# EAGLE design Arduino-DUE-V03 (EAGLE 7.2.0)
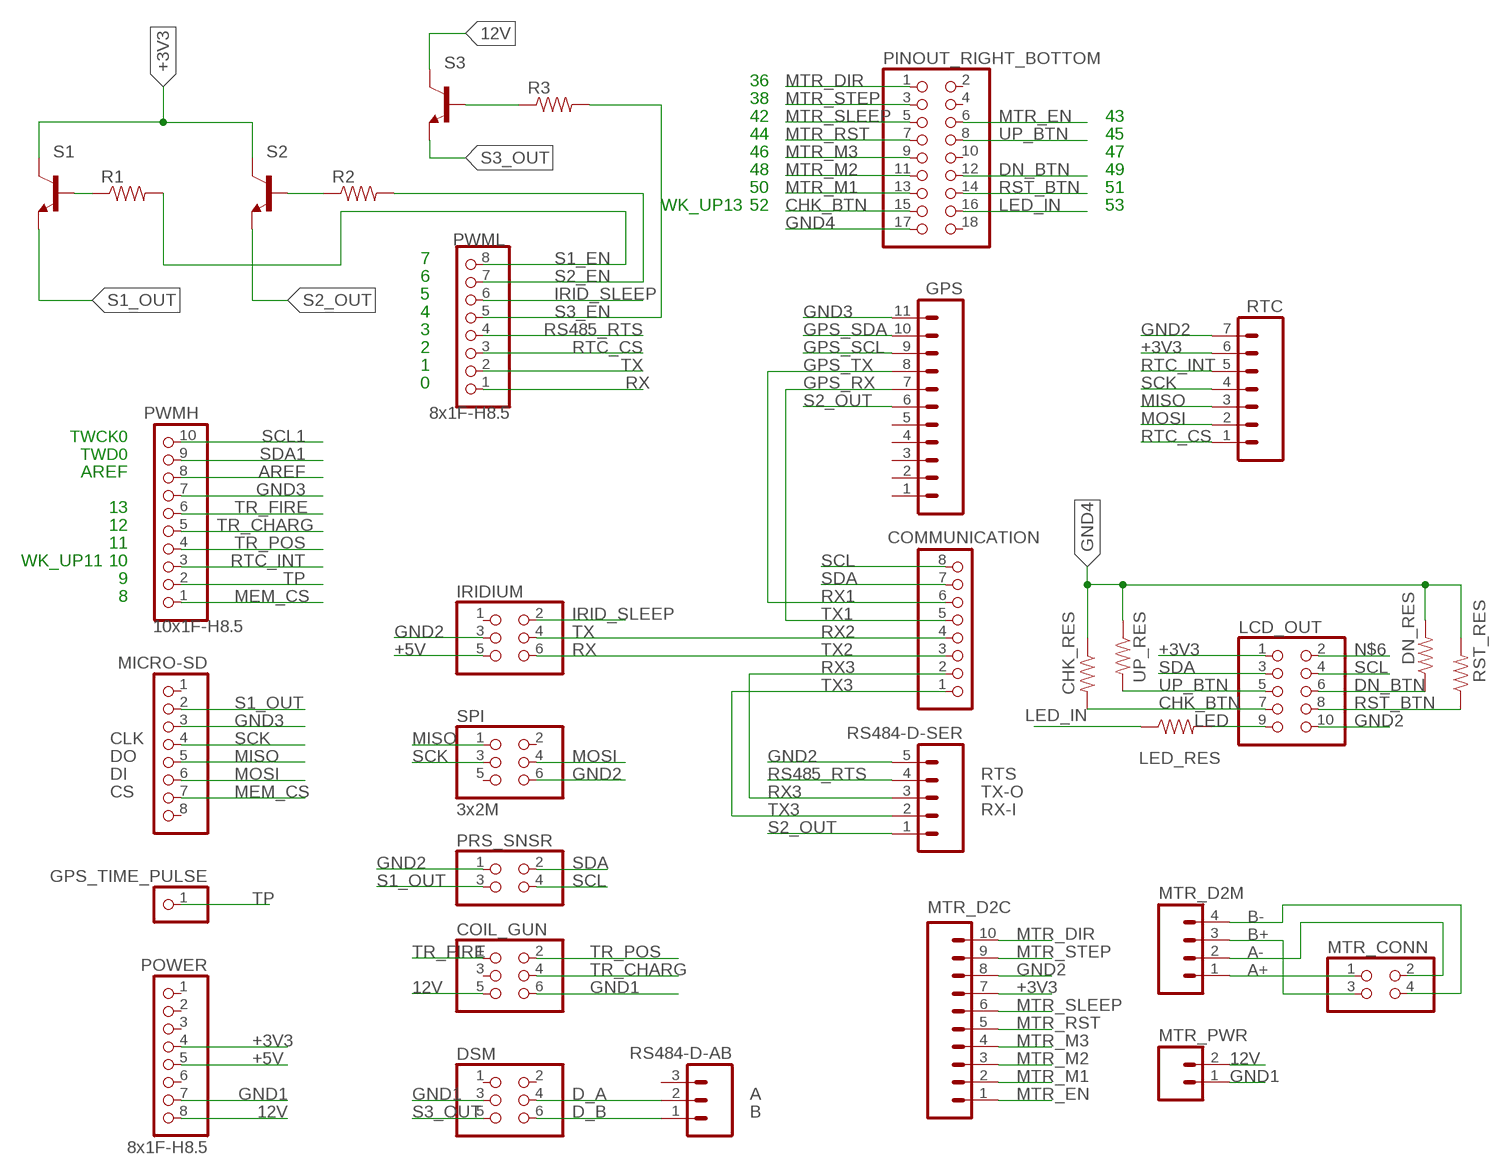
[diagram p0: schematic, sheet 1]

## Parts
CHK_RES  RESISTORPTH-1/4W  [AXIAL-0.4]
COIL_GUN  PINHD-2X3  [2X03]
COMMUNICATION  8x1F-H8.5  PINHD-1X8  [1X08]
DN_RES  RESISTORPTH-1/4W  [AXIAL-0.4]
DSM  PINHD-2X3  [2X03]
GPS  M111.27MM  [1X11-1.27MM]
GPS_TIME_PULSE  PINHD-1X1  [1X01]
IRIDIUM  PINHD-2X3  [2X03]
LCD_OUT  PINHD-2X5  [2X05]
LED_RES  RESISTORPTH-1/4W  [AXIAL-0.4]
MICRO-SD  PINHD-1X8BIG  [1X08-BIG]
MTR_CONN  PINHD-2X2  [2X02]
MTR_D2C  M10SILK_FEMALE_PTH  [1X10]
MTR_D2M  M04NO_SILK_ALL_ROUND  [1X04_NO_SILK_ALL_ROUND]
MTR_PWR  M02PTH  [1X02]
PINOUT_RIGHT_BOTTOM  PINHD-2X9  [2X09]
POWER  8x1F-H8.5  PINHD-1X8  [1X08]
PRS_SNSR  PINHD-2X2  [2X02]
PWMH  10x1F-H8.5  PINHD-1X10  [1X10]
PWML  8x1F-H8.5  PINHD-1X8  [1X08]
R1  RESISTORPTH-1/4W  [AXIAL-0.4]
R2  RESISTORPTH-1/4W  [AXIAL-0.4]
R3  RESISTORPTH-1/4W  [AXIAL-0.4]
RS484-D-AB  M03PTH  [1X03]
RS484-D-SER  M05PTH  [1X05]
RST_RES  RESISTORPTH-1/4W  [AXIAL-0.4]
RTC  M07  [1X07]
S1  2N3904  [TO92]
S2  2N3904  [TO92]
S3  2N3904  [TO92]
SPI  3x2M  PINHD-2X3  [2X03]
UP_RES  RESISTORPTH-1/4W  [AXIAL-0.4]

## Nets
12V [12V]: COIL_GUN.5 MTR_PWR.2 POWER.8 S3.1(C)
+3V3 [Power]: LCD_OUT.1 MTR_D2C.7 POWER.4 RTC.6 S1.1(C) S2.1(C)
+5V [Power]: IRIDIUM.5 POWER.5
A+ [12V]: MTR_CONN.1 MTR_D2M.1
A- [12V]: MTR_CONN.2 MTR_D2M.2
AREF: PWMH.8
B+ [12V]: MTR_CONN.3 MTR_D2M.3
B- [12V]: MTR_CONN.4 MTR_D2M.4
CHK_BTN: CHK_RES.P$2 LCD_OUT.7 PINOUT_RIGHT_BOTTOM.15
D_A [Power]: DSM.4 RS484-D-AB.2
D_B [Power]: DSM.6 RS484-D-AB.1
DN_BTN: DN_RES.P$1 LCD_OUT.6 PINOUT_RIGHT_BOTTOM.12
GND1 [12V]: COIL_GUN.6 DSM.3 MTR_PWR.1 POWER.7
GND2 [Power]: IRIDIUM.3 LCD_OUT.10 MTR_D2C.8 PRS_SNSR.1 RS484-D-SER.5 RTC.7 SPI.6
GND3 [Power]: GPS.11 MICRO-SD.3 PWMH.7
GND4 [Power]: CHK_RES.P$1 DN_RES.P$2 PINOUT_RIGHT_BOTTOM.17 RST_RES.P$2 UP_RES.P$1
GPS_RX: COMMUNICATION.5 GPS.7
GPS_SCL: GPS.9
GPS_SDA: GPS.10
GPS_TX: COMMUNICATION.6 GPS.8
IRID_SLEEP: IRIDIUM.2 PWML.6
LED: LCD_OUT.9 LED_RES.P$2
LED_IN: LED_RES.P$1 PINOUT_RIGHT_BOTTOM.16
MEM_CS: MICRO-SD.7 PWMH.1
MISO: MICRO-SD.5 RTC.3 SPI.1
MOSI: MICRO-SD.6 RTC.2 SPI.4
MTR_DIR: MTR_D2C.10 PINOUT_RIGHT_BOTTOM.1
MTR_EN: MTR_D2C.1 PINOUT_RIGHT_BOTTOM.6
MTR_M1: MTR_D2C.2 PINOUT_RIGHT_BOTTOM.13
MTR_M2: MTR_D2C.3 PINOUT_RIGHT_BOTTOM.11
MTR_M3: MTR_D2C.4 PINOUT_RIGHT_BOTTOM.9
MTR_RST: MTR_D2C.5 PINOUT_RIGHT_BOTTOM.7
MTR_SLEEP: MTR_D2C.6 PINOUT_RIGHT_BOTTOM.5
MTR_STEP: MTR_D2C.9 PINOUT_RIGHT_BOTTOM.3
N$1: R1.P$1 S1.2(B)
N$2: R2.P$1 S2.2(B)
N$4: R3.P$1 S3.2(B)
N$6: LCD_OUT.2
RS485_RTS: PWML.4 RS484-D-SER.4
RST_BTN: LCD_OUT.8 PINOUT_RIGHT_BOTTOM.14 RST_RES.P$1
RTC_CS: PWML.3 RTC.1
RTC_INT: PWMH.3 RTC.5
RX [USB]: PWML.1
RX2: COMMUNICATION.4 IRIDIUM.4
RX3: COMMUNICATION.2 RS484-D-SER.3
S1_EN: PWML.8 R1.P$2
S1_OUT [Power]: MICRO-SD.2 PRS_SNSR.3 S1.3(E)
S2_EN: PWML.7 R2.P$2
S2_OUT [Power]: GPS.6 RS484-D-SER.1 S2.3(E)
S3_EN: PWML.5 R3.P$2
S3_OUT [12V]: DSM.5 S3.3(E)
SCK: MICRO-SD.4 RTC.4 SPI.3
SCL: COMMUNICATION.8 LCD_OUT.4 PRS_SNSR.4
SCL1: PWMH.10
SDA: COMMUNICATION.7 LCD_OUT.3 PRS_SNSR.2
SDA1: PWMH.9
TP: GPS_TIME_PULSE.1 PWMH.2
TR_CHARG: COIL_GUN.4 PWMH.5
TR_FIRE: COIL_GUN.1 PWMH.6
TR_POS: COIL_GUN.2 PWMH.4
TX: PWML.2
TX2: COMMUNICATION.3 IRIDIUM.6
TX3: COMMUNICATION.1 RS484-D-SER.2
UP_BTN: LCD_OUT.5 PINOUT_RIGHT_BOTTOM.8 UP_RES.P$2
Unconnected: COIL_GUN.3 DSM.1 DSM.2 GPS.1 GPS.2 GPS.3 GPS.4 GPS.5 IRIDIUM.1 MICRO-SD.1 MICRO-SD.8 PINOUT_RIGHT_BOTTOM.2 PINOUT_RIGHT_BOTTOM.4 PINOUT_RIGHT_BOTTOM.10 PINOUT_RIGHT_BOTTOM.18 POWER.1 POWER.2 POWER.3 POWER.6 RS484-D-AB.3 SPI.2 SPI.5

## Notes on the sheet
- 36
- 38
- 42 | 43
- 44 | 45
- 46 | 47
- 48 | 49
- 50 | 51
- WK_UP13 | 52 | 53
- 7
- 6
- 5
- 4
- 3
- 2
- 1
- 0
- TWCK0
- TWD0
- AREF
- 13
- 12
- 11
- WK_UP11 | 10
- 9
- 8 | RX1
- TX1
- TX
- RX
- CLK
- DO
- DI | RTS
- CS | TX-O
- RX-I
- A
- B

## Library data of the parts
CHK_RES DN_RES LED_RES R1-R3 RST_RES UP_RES = SparkFun-Passives:RESISTOR: Resistor Basic schematic elements and footprints for 0603, 1206, and PTH resistors.
COIL_GUN DSM IRIDIUM = pinhead:PINHD-2X3: PIN HEADER
COMMUNICATION POWER PWML = SmartPrj:PINHD-1X8: PIN HEADER
GPS = SparkFun-Connectors:M11: Header 11 Standard 11-pin 0.1" header. Use with straight break away headers (SKU : PRT-00116), right angle break away headers (PRT-00553), swiss pins (PRT-00743), machine pins (PRT-00117), and female headers (PRT-00115).
GPS_TIME_PULSE = pinhead:PINHD-1X1: PIN HEADER
LCD_OUT = pinhead:PINHD-2X5: PIN HEADER
MICRO-SD = adafruit:PINHD-1X8: PIN HEADER
MTR_CONN PRS_SNSR = pinhead:PINHD-2X2: PIN HEADER
MTR_D2C = SparkFun-Connectors:M10: Header 10 Standard 10-pin 0.1" header. Use with straight break away headers (SKU : PRT-00116), right angle break away headers (PRT-00553), swiss pins (PRT-00743), machine pins (PRT-00117), and female headers (PRT-00115).; PROD_ID: CONN-11563
MTR_D2M = SparkFun-Connectors:M04: Header 4 Standard 4-pin 0.1" header. Use with straight break away headers (SKU : PRT-00116), right angle break away headers (PRT-00553), swiss pins (PRT-00743), machine pins (PRT-00117), and female headers (PRT-00115). Molex polarized connector foot print use with SKU : PRT-08231 with associated crimp pins and housings. 1MM SMD Version SKU: PRT-10208
MTR_PWR = SparkFun-Connectors:M02: Standard 2-pin 0.1" header. Use with - straight break away headers ( PRT-00116) - right angle break away headers (PRT-00553) - swiss pins (PRT-00743) - machine pins (PRT-00117) - female headers (PRT-00115) Molex polarized connector foot print use with: PRT-08233 with associated crimp pins and housings. 2.54_SCREWTERM for use with PRT-10571. 3.5mm Screw Terminal footprints for PRT-08084 5mm Screw Terminal footprints for use with PRT-08432
PINOUT_RIGHT_BOTTOM = pinhead:PINHD-2X9: PIN HEADER
PWMH = SmartPrj:PINHD-1X10: PIN HEADER
RS484-D-AB = SparkFun-Connectors:M03: Header 3 Standard 3-pin 0.1" header. Use with straight break away headers (SKU : PRT-00116), right angle break away headers (PRT-00553), swiss pins (PRT-00743), machine pins (PRT-00117), and female headers (PRT-00115). Molex polarized connector foot print use with SKU : PRT-08232 with associated crimp pins and housings.
RS484-D-SER = SparkFun-Connectors:M05: Header 5 Standard 5-pin 0.1" header. Use with straight break away headers (SKU : PRT-00116), right angle break away headers (PRT-00553), swiss pins (PRT-00743), machine pins (PRT-00117), and female headers (PRT-00115). Molex polarized connector foot print use with SKU : PRT-08230 with associated crimp pins and housings.
RTC = SparkFun-Connectors:M07: Header 7 Standard 7-pin 0.1" header. Use with straight break away headers (SKU : PRT-00116), right angle break away headers (PRT-00553), swiss pins (PRT-00743), machine pins (PRT-00117), and female headers (PRT-00115). NOTES ON THE VARIANTS LOCK and LOCK_LONGPADS... This footprint was designed to help hold the alignment of a through-hole component (i.e. 7-pin header) while soldering it into place. You may notice that each hole has been shifted either up or down by 0.005 of an inch from it's more standard position (which is usually a perfectly straight line). This slight alteration caused the pins (the squares in the middle) to touch the edges of the holes. Because they are alternating, it causes a "brace" to hold the header in place. 0.005 has proven to be the perfect amount of "off-center" position when using our standard breakaway headers. Although looks a little odd when you look at the bare footprint, once you have a header in there, the alteration is very hard to notice. Also, if you push a header all the way into place, it is covered up entirely on the bottom side. This idea of altering the position of holes to aid alignment will be further integrated into the Sparkfun Library for other footprints. It can help hold any component with 3 or more connection pins.
S1-S3 = transistor:2N3904: NPN TRANSISTOR
SPI = SmartPrj:PINHD-2X3: PIN HEADER

## Net classes
0 default: width 0.203 mm, drill 0.406 mm, clearance 0.203 mm
1 USB: width 0.889 mm, drill 0.889 mm, clearance 0.889 mm
5 12V: width 0.61 mm, drill 0.406 mm, clearance 0.61 mm
6 Power: width 0.381 mm, drill 0.406 mm, clearance 0.381 mm

## Board
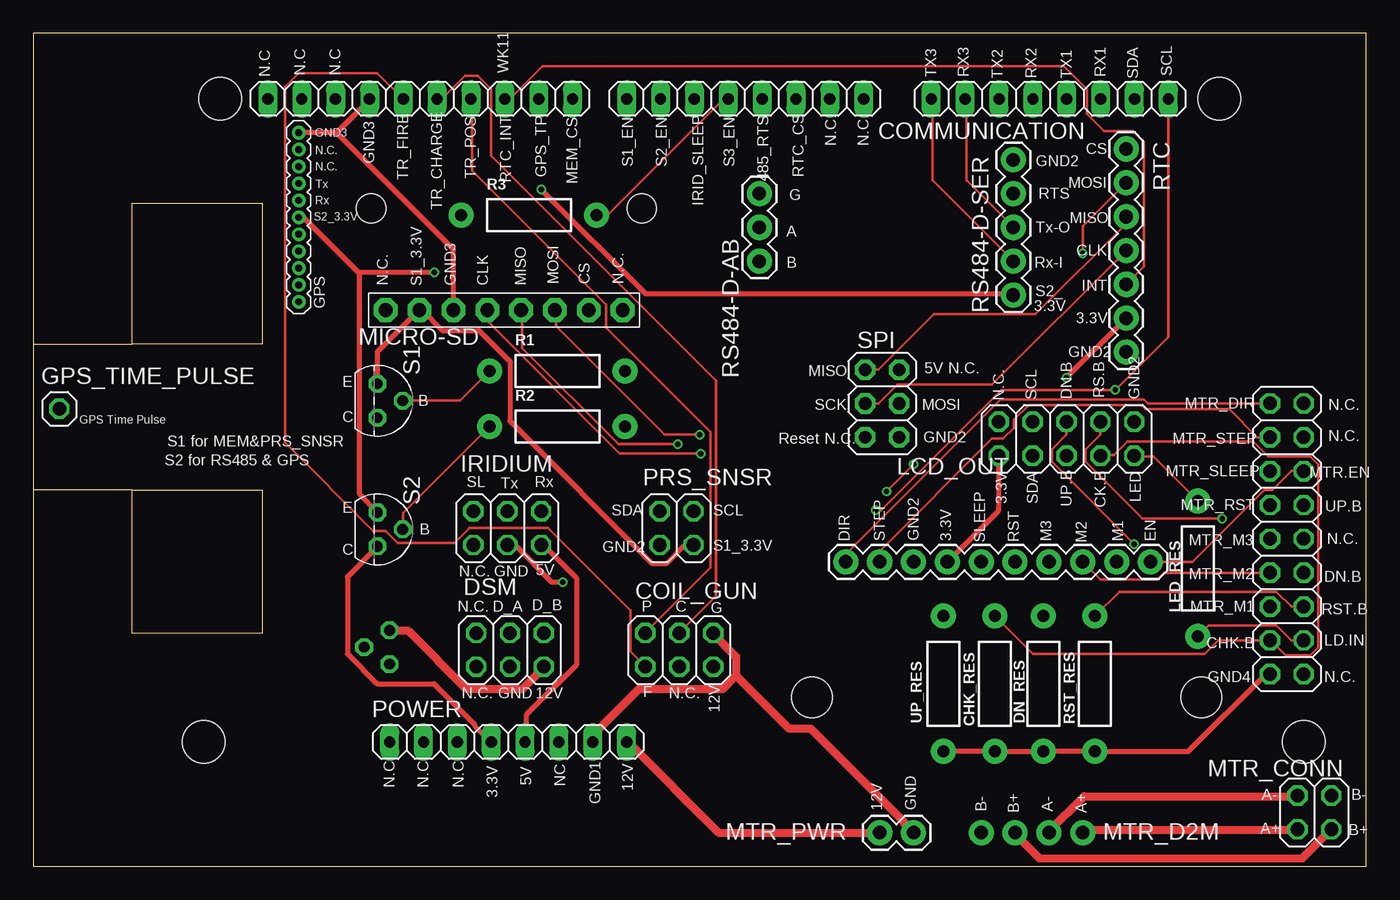
[diagram p1: board, top side]
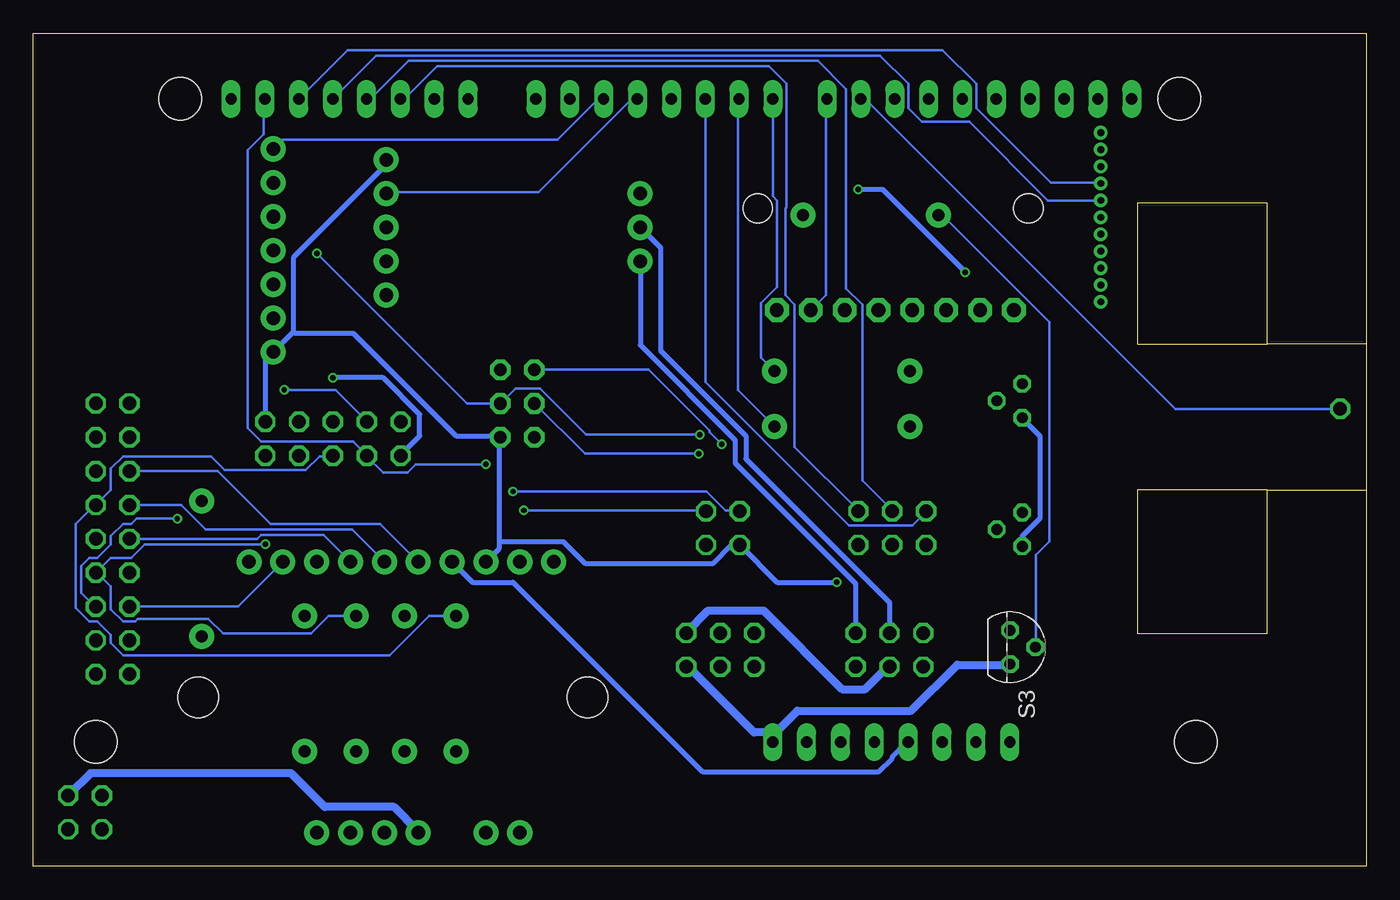
[diagram p2: board, bottom side, seen from below]

Size 100 x 62.52 mm. Coordinates in mm from the lower left corner, seen from the top.
Outline: 0,39.22 0,62.52 100,62.52 100,0 0,0 0,28.25
Outline: 0,39.22 7.43,39.22
Outline: 7.43,39.22 7.43,49.78 17.19,49.78 17.19,39.22 7.43,39.22
Outline: 0,39.22 0,28.25
Outline: 7.43,28.25 17.19,28.25 17.19,17.49 7.43,17.49 7.43,28.25
Outline: 7.43,28.25 0,28.25
Copper layers (1*16): Top 0.035mm / dielectric 1.5mm / Bottom 0.035mm
Design rules "Elecrow_2-layer_eagle_rule": minimum track width 6mil, minimum drill 12mil, track to track 6mil, track to pad 6mil, pad to pad 6mil, via to via 6mil, smd to smd 0mil, copper to edge 10mil, drill to drill 10mil, minimum pad ring 10mil, minimum via ring 6mil, stop-mask expansion 2mil, vias tented up to drill 100mil, thermal gap 10mil
Holes 3.2 mm at 14.04,57.61 88.97,57.61 95.32,9.35 12.77,9.35
Holes 2.2 mm at 45.66,49.38 25.34,49.38

### Footprints (pad centres in the part's own frame; a part is rotated, then mirrored left to right if it is on the bottom)
AXIAL-0.4 = drill 0.9 pad 1.88: P$1 -5.08,0; P$2 5.08,0
2X03 = drill 1.016 octagon: 1 -2.54,-1.27; 2 -2.54,1.27; 3 0,-1.27; 4 0,1.27; 5 2.54,-1.27; 6 2.54,1.27
1X08 = drill 0.85 pad 1.422 long: 1 -8.89,0; 2 -6.35,0; 3 -3.81,0; 4 -1.27,0; 5 1.27,0; 6 3.81,0; 7 6.35,0; 8 8.89,0
1X11-1.27MM = drill 0.508 pad 1: 1 0,0; 2 1.27,0; 3 2.54,0; 4 3.81,0; 5 5.08,0; 6 6.35,0; 7 7.62,0; 8 8.89,0; 9 10.16,0; 10 11.43,0; 11 12.7,0
1X01 = drill 1.016 octagon: 1 0,0
2X05 = drill 1.016 octagon: 1 -5.08,-1.27; 2 -5.08,1.27; 3 -2.54,-1.27; 4 -2.54,1.27; 5 0,-1.27; 6 0,1.27; 7 2.54,-1.27; 8 2.54,1.27; 9 5.08,-1.27; 10 5.08,1.27
1X08-BIG = drill 1.016 pad 1.778 octagon: 1 -8.89,0; 2 -6.35,0; 3 -3.81,0; 4 -1.27,0; 5 1.27,0; 6 3.81,0; 7 6.35,0; 8 8.89,0
2X02 = drill 1.016 octagon: 1 -1.27,-1.27; 2 -1.27,1.27; 3 1.27,-1.27; 4 1.27,1.27
1X10 = drill 1.016 pad 1.88: 1 0,0; 2 2.54,0; 3 5.08,0; 4 7.62,0; 5 10.16,0; 6 12.7,0; 7 15.24,0; 8 17.78,0; 9 20.32,0; 10 22.86,0
1X04_NO_SILK_ALL_ROUND = drill 1.016 pad 1.88: 1 0,0; 2 2.54,0; 3 5.08,0; 4 7.62,0
1X02 = drill 1.016 pad 1.88: 1 0,0; 2 2.54,0
2X09 = drill 1.016 octagon: 1 -10.16,-1.27; 2 -10.16,1.27; 3 -7.62,-1.27; 4 -7.62,1.27; 5 -5.08,-1.27; 6 -5.08,1.27; 7 -2.54,-1.27; 8 -2.54,1.27; 9 0,-1.27; 10 0,1.27; 11 2.54,-1.27; 12 2.54,1.27; 13 5.08,-1.27; 14 5.08,1.27; 15 7.62,-1.27; 16 7.62,1.27; 17 10.16,-1.27; 18 10.16,1.27
1X10' = drill 0.85 pad 1.422 long: 1 -11.43,0; 2 -8.89,0; 3 -6.35,0; 4 -3.81,0; 5 -1.27,0; 6 1.27,0; 7 3.81,0; 8 6.35,0; 9 8.89,0; 10 11.43,0
1X03 = drill 1.016 pad 1.88: 1 0,0; 2 2.54,0; 3 5.08,0
1X05 = drill 1.016 pad 1.88: 1 0,0; 2 2.54,0; 3 5.08,0; 4 7.62,0; 5 10.16,0
1X07 = drill 1.016 pad 1.88: 1 0,0; 2 2.54,0; 3 5.08,0; 4 7.62,0; 5 10.16,0; 6 12.7,0; 7 15.24,0
TO92 = drill 0.813 octagon: 1 1.27,0; 2 0,1.905; 3 -1.27,0
2X03' = drill 0.95 pad 1.55 octagon: 1 -2.54,-1.27; 2 -2.54,1.27; 3 0,-1.27; 4 0,1.27; 5 2.54,-1.27; 6 2.54,1.27
STAND-OFF-TIGHT = hole 3.048: 0,0

### Placement (x,y rotation side)
CHK_RES  72.14,13.72 90 top
COIL_GUN  48.46,16.26 0 top
COMMUNICATION  76.27,57.61 0 top
DN_RES  75.79,13.72 270 top
DSM  35.76,16.26 0 top
GPS  19.91,42.37 90 top
GPS_TIME_PULSE  1.95,34.34 0 top
IRIDIUM  35.56,25.4 0 top
LCD_OUT  77.52,32.11 0 top
LED_RES  87.38,22.35 90 top
MICRO-SD  35.32,41.76 0 top
MTR_CONN  96.11,4.06 0 top
MTR_D2C  83.82,22.86 180 top
MTR_D2M  78.74,2.54 180 top
MTR_PWR  66.04,2.54 180 top
PINOUT_RIGHT_BOTTOM  94.05,24.59 270 top
POWER  35.63,9.35 0 top
PRS_SNSR  48.26,25.4 0 top
PWMH  10x1F-H8.5  [1X10']  29.02,57.61 180 top
PWML  53.41,57.61 180 top
R1  39.32,37.19 0 top
R2  39.32,33.02 0 top
R3  37.19,48.87 0 top
RS484-D-AB  54.47,45.42 90 top
RS484-D-SER  73.52,42.88 90 top
RST_RES  79.65,13.72 270 top
RTC  81.99,53.85 270 top
S1  25.81,34.95 270 top
S2  25.81,25.3 270 top
S3  26.72,16.46 270 bottom
SPI  3x2M  [2X03']  63.69,34.75 270 top
U$1  [STAND-OFF-TIGHT]  58.42,12.7 0 top
U$2  [STAND-OFF-TIGHT]  87.63,12.7 0 top
UP_RES  68.28,13.72 90 top

### Tracks (layer width: path | path; a pad name or v marks a point on that pad's centre or on a via)
12V
  Top 0.61: MTR_PWR.2 51.41,2.54 44.6,9.35 POWER.8
  Bottom 0.61: S3.1 26.72,15.14 30.68,15.14 34.14,11.68 42.67,11.68 44.5,9.86 44.5,9.35 POWER.8 44.7,10.06 45.92,10.06 50.8,14.94 51,14.94 COIL_GUN.5
+3V3  (via drill 0.41)
  Top 0.381: POWER.4 34.34,9.35 33.12,10.57 33.12,10.67 30.07,13.72 25.81,13.72 23.57,15.95 23.57,21.74 25.81,23.98 S2.1 | LCD_OUT.1 72.44,26.72 MTR_D2C.7 | v77.52,36.68 RTC.6
  Bottom 0.381: S2.1 25.81,24.79 24.49,26.11 24.49,32.31 25.81,33.63 S1.1 | v77.52,36.68 73.76,36.68 71.02,33.93 71.02,32.31 72.44,30.89 LCD_OUT.1 | MTR_D2C.7 67.06,21.34 64.01,21.34 49.78,7.11 36.58,7.11 35.56,8.13 35.56,8.23 34.44,9.35 POWER.4
+5V
  Top 0.381: POWER.5 36.98,9.35 36.98,11.38 40.74,15.14 40.74,21.64 38.3,24.08 38.1,24.08 IRIDIUM.5
A+
  Top 0.61: MTR_D2M.1 78.94,2.74 94.79,2.74 MTR_CONN.1
A-
  Top 0.61: MTR_D2M.2 76.2,2.64 78.84,5.28 94.79,5.28 MTR_CONN.2
B+
  Top 0.61: MTR_CONN.3 95.2,0.61 75.49,0.61 73.66,2.44 MTR_D2M.3
B-
  Bottom 0.61: MTR_CONN.4 95.71,7.01 80.67,7.01 78.13,4.47 72.95,4.47 71.12,2.64 MTR_D2M.4
CHK_BTN
  Top 0.203: CHK_RES.P$2 74.98,15.95 87.88,15.95 88.9,16.97 PINOUT_RIGHT_BOTTOM.15 92.86,16.97 93.98,15.85 95.81,15.85 96.42,16.46 96.42,30.18 95.81,30.79 92.66,30.79 91.54,31.9 82.09,31.9 81.08,30.89 80.06,30.89 LCD_OUT.7
D_A
  Bottom 0.381: DSM.4 35.76,19.81 46.53,30.58 46.53,32.31 52.93,38.71 52.93,46.43 54.46,47.95 RS484-D-AB.2
D_B
  Bottom 0.381: DSM.6 38.3,21.23 47.35,30.28 47.35,32 54.46,39.12 54.46,45.41 RS484-D-AB.1
DN_BTN  (via drill 0.41)
  Top 0.203: LCD_OUT.6 77.52,32.41 76.4,31.29 76.4,30.38 v82.6,24.18
  Bottom 0.203: v82.6,24.18 91.64,24.18 92.66,23.16 94.18,23.16 95.3,22.05 PINOUT_RIGHT_BOTTOM.12 95.2,22.05 94.18,21.03 94.18,19.3 93.27,18.39 92.35,18.39 92.15,18.59 86.87,18.59 85.75,17.48 79.15,17.48 77.83,18.8 DN_RES.P$1
GND1
  Top 0.61: 52.73,14.33 51.71,13.31 45.41,13.31 42.06,9.96 42.06,9.35 POWER.7 | 52.73,14.33 52.73,15.75 51,17.48 COIL_GUN.6 | MTR_PWR.1 65.33,3.25 65.33,3.35 58.32,10.36 56.69,10.36 52.73,14.33
  Bottom 0.61: DSM.3 35.76,14.94 35.97,14.94 37.59,13.31 39.32,13.31 45.21,19.2 49.38,19.2 51,17.58 COIL_GUN.6
GND2  (via drill 0.41)
  Top 0.381: v39.73,21.34 38.91,21.34 36.17,24.08 35.56,24.08 IRIDIUM.3
  Bottom 0.381: v39.73,21.34 44.2,21.34 PRS_SNSR.1 47.14,24.08 47.65,24.08 48.97,22.76 58.62,22.76 60.25,24.38 65.02,24.38 | 65.02,24.38 65.02,23.88 MTR_D2C.8 | 65.02,24.38 65.02,32.21 SPI.6 65.13,32.31 68.28,32.31 76,40.03 80.37,40.03 80.47,40.13 | LCD_OUT.10 82.6,38 RTC.7 80.47,40.13 | 80.47,40.13 80.47,45.72 73.56,52.63 73.56,53.03 RS484-D-SER.5
GND3
  Top 0.381: 22.76,55.07 GPS.11 | 22.76,55.07 25.3,57.61 PWMH.7 | 22.76,55.07 31.5,46.33 31.5,41.76 MICRO-SD.3
GND4
  Top 0.381: UP_RES.P$1 CHK_RES.P$1 DN_RES.P$2 RST_RES.P$2 86.67,8.64 92.46,14.43 PINOUT_RIGHT_BOTTOM.17
GPS_RX
  Bottom 0.203: GPS.7 23.88,49.99 29.77,55.88 33.33,55.88 34.34,56.9 34.34,58.73 36.47,60.86 74.27,60.86 77.52,57.61 COMMUNICATION.5
GPS_TX
  Bottom 0.203: GPS.8 19.91,51.31 23.67,51.31 29.26,56.9 29.26,58.73 31.8,61.27 76.4,61.27 80.06,57.61 COMMUNICATION.6
IRID_SLEEP
  Bottom 0.203: PWML.6 49.58,57.61 49.58,36.37 38.81,25.6 34.04,25.6 33.02,26.62 IRIDIUM.2
LED
  Top 0.203: LED_RES.P$2 84.02,30.79 82.6,30.79 LCD_OUT.9
LED_IN
  Top 0.203: PINOUT_RIGHT_BOTTOM.16 94.39,16.97 93.27,18.09 88.19,18.09 LED_RES.P$1
MEM_CS
  Bottom 0.203: PWMH.1 40.54,57.61 40.54,42.88 41.66,41.76 MICRO-SD.7
MISO  (via drill 0.41)
  Top 0.203: SPI.1 63.4,37.29 67.56,41.45 75.18,41.45 81.99,48.26 RTC.3 | v48.36,31.7 43.89,31.7 36.68,38.91 36.68,41.76 MICRO-SD.5
  Bottom 0.203: v48.36,31.7 49.28,32.61 49.28,32.72 53.85,37.29 SPI.1
MOSI  (via drill 0.41)
  Top 0.203: v78.74,46.02 78.74,48.06 RTC.2 | v49.99,32.41 47.35,32.41 39.22,40.54 39.22,41.76 MICRO-SD.6
  Bottom 0.203: v78.74,46.02 67.46,34.75 SPI.4 64.92,34.75 63.8,35.87 61.98,35.87 58.52,32.41 v49.99,32.41
MTR_DIR
  Top 0.203: PINOUT_RIGHT_BOTTOM.1 83.62,34.75 83.31,35.05 72.54,35.05 60.96,23.47 MTR_D2C.10
MTR_EN
  Top 0.203: PINOUT_RIGHT_BOTTOM.6 94.39,29.67 92.96,28.25 92.35,28.25 86.97,22.86 MTR_D2C.1
MTR_M1
  Bottom 0.203: PINOUT_RIGHT_BOTTOM.13 84.63,19.51 MTR_D2C.2
MTR_M2
  Top 0.203: PINOUT_RIGHT_BOTTOM.11 84.84,22.05 84.33,21.54 80.06,21.54 MTR_D2C.3
MTR_M3
  Bottom 0.203: PINOUT_RIGHT_BOTTOM.9 83.21,24.59 82.91,24.89 78.23,24.89 MTR_D2C.4
MTR_RST
  Bottom 0.203: PINOUT_RIGHT_BOTTOM.7 88.9,27.13 87.07,25.3 76.1,25.3 MTR_D2C.5
MTR_SLEEP
  Bottom 0.203: PINOUT_RIGHT_BOTTOM.5 86.16,29.67 82.19,25.7 73.97,25.7 MTR_D2C.6
MTR_STEP
  Top 0.203: PINOUT_RIGHT_BOTTOM.3 91.85,32.21 89.71,34.34 83.41,34.34 83.11,34.65 74.68,34.65 73.56,33.53 73.56,32.92 72.75,32.11 71.93,32.11 63.5,23.67 MTR_D2C.9
N$1
  Top 0.203: S1.2 32,34.95 R1.P$1
N$2
  Top 0.203: R2.P$1 27.74,26.52 27.74,25.3 S2.2
N$4
  Bottom 0.203: R3.P$1 31.8,48.87 23.77,40.84 23.77,24.38 24.79,23.37 24.79,16.46 S3.2
RS485_RTS
  Bottom 0.203: PWML.4 55.07,57.61 62.08,50.6 73.46,50.6 RS484-D-SER.4
RST_BTN  (via drill 0.41)
  Top 0.203: PINOUT_RIGHT_BOTTOM.14 94.39,19.51 93.27,20.62 81.48,20.62 RST_RES.P$1 | LCD_OUT.8 80.06,32.41 78.94,31.29 78.94,30.38 83.21,26.11 v89.2,26.11
  Bottom 0.203: v89.2,26.11 92.25,26.11 92.66,25.7 93.27,25.7 94.18,24.79 94.18,24.18 95.2,23.16 95.81,23.16 96.42,22.55 96.42,20.52 95.4,19.51 PINOUT_RIGHT_BOTTOM.14
RTC_CS
  Bottom 0.203: PWML.3 57.61,57.61 60.66,54.56 81.28,54.56 RTC.1
RTC_INT
  Top 0.203: PWMH.3 35.76,57.61 38.2,60.05 77.32,60.05 79.05,58.32 79.05,56.49 80.37,55.17 82.5,55.17 83.31,54.36 83.31,45.01 RTC.5
RX2
  Bottom 0.203: COMMUNICATION.4 74.68,57.61 71.83,60.45 41.15,60.45 39.01,58.32 39.01,43.38 37.8,42.16 37.8,28.96 35.56,26.72 IRIDIUM.4
RX3
  Top 0.203: COMMUNICATION.2 70,57.61 70,51.51 73.46,48.06 RS484-D-SER.3
S1_EN
  Bottom 0.203: R1.P$2 45.41,38.2 45.41,42.27 44.2,43.48 44.2,49.99 44.5,50.29 44.5,57.61 PWML.8
S1_OUT
  Top 0.381: S1.3 25.81,38.61 28.96,41.76 MICRO-SD.2 29.16,41.76 30.68,40.23 33.43,40.23 35.76,37.9 35.76,33.43 46.43,22.76 47.55,22.76 48.87,24.08 49.48,24.08 PRS_SNSR.3
S2_EN
  Bottom 0.203: R2.P$2 47.14,35.76 47.14,57.61 PWML.7
S2_OUT  (via drill 0.41)
  Top 0.381: 24.49,44.5 20.32,48.67 19.91,48.67 GPS.6 | 24.49,44.5 24.49,27.94 25.81,26.62 S2.3 | v38.1,50.8 45.92,42.98 73.46,42.98 RS484-D-SER.1 | v30.07,44.6 24.59,44.6 24.49,44.5
  Bottom 0.381: v38.1,50.8 36.27,50.8 v30.07,44.6
S3_EN
  Top 0.203: PWML.5 51.82,57.61 43.08,48.87 R3.P$2
S3_OUT
  Top 0.61: S3.3 26.72,17.68 28.14,17.68 32.51,13.31 36.68,13.31 38.3,14.94 DSM.5
SCK  (via drill 0.41)
  Top 0.203: SPI.3 63.4,34.75 64.82,36.17 71.93,36.17 RTC.4 | v50.09,30.99 43.99,30.99 34.14,40.84 34.14,41.76 MICRO-SD.4
  Bottom 0.203: v50.09,30.99 58.62,30.99 62.38,34.75 SPI.3
SCL  (via drill 0.41)
  Top 0.203: COMMUNICATION.8 85.14,57.61 85.14,39.73 v81.18,35.76 72.64,35.76 63.6,26.72 v63.2,26.72
  Bottom 0.203: v81.18,35.76 77.32,35.76 74.98,33.43 LCD_OUT.4 | v63.2,26.72 49.58,26.72 PRS_SNSR.4
SDA  (via drill 0.41)
  Top 0.203: v66.04,30.18 v64.01,28.14
  Bottom 0.203: COMMUNICATION.7 82.7,57.61 82.7,54.97 83.92,53.75 83.92,32.92 82.91,31.9 76,31.9 74.98,30.89 LCD_OUT.3 74.98,30.79 73.76,29.57 71.93,29.57 71.32,30.18 v66.04,30.18 | v64.01,28.14 49.48,28.14 48.06,26.72 47.04,26.72 PRS_SNSR.2
TP
  Bottom 0.203: PWMH.2 37.59,57.61 14.33,34.34 GPS_TIME_PULSE.1
TR_CHARG
  Top 0.203: PWMH.5 30.68,57.61 32.41,59.33 33.33,59.33 34.34,58.32 34.34,53.34 51.21,36.47 51.21,20.32 48.46,17.58 COIL_GUN.4
TR_FIRE
  Top 0.203: PWMH.6 27.74,57.61 25.81,59.54 19.91,59.54 18.9,58.52 18.9,31.8 25.5,25.2 26.42,25.2 27.33,24.28 31.6,24.28 32.72,25.4 38.61,25.4 44.81,19.2 44.81,16.15 45.92,15.04 COIL_GUN.1
TR_POS
  Top 0.203: PWMH.4 32.92,57.61 32.92,52.22 42.98,42.16 42.98,40.44 50.8,32.61 50.8,22.45 45.92,17.58 COIL_GUN.2
TX2
  Bottom 0.203: COMMUNICATION.3 72.14,57.61 69.7,60.05 44.81,60.05 43.48,58.73 43.48,49.48 43.59,49.38 43.59,42.88 42.88,42.16 42.88,31.5 38.1,26.72 IRIDIUM.6
TX3
  Top 0.203: COMMUNICATION.1 67.46,57.61 67.46,51.51 73.46,45.52 RS484-D-SER.2
UP_BTN
  Bottom 0.203: LCD_OUT.5 77.52,30.79 78.54,30.79 79.55,29.77 85.65,29.77 86.67,30.79 93.27,30.79 94.18,29.87 94.18,28.25 95.3,27.13 PINOUT_RIGHT_BOTTOM.8 95.4,27.13 96.83,25.7 96.83,19.41 95.81,18.39 95.2,18.39 94.18,17.37 94.18,16.76 93.27,15.85 73.25,15.85 70.31,18.8 UP_RES.P$2

### Text on the board
tNames: WK11 | N.C | N.C | N.C | TX3 | RX3 | TX2 | RX2 | TX1 | RX1 | SDA | SCL | GND3 | N.C. | N.C. | N.C. | GND3 | S1_EN | S2_EN | S3_EN | GND2 | CS | N.C. | TR_FIRE | TR_POS | GPS_TP | RTC_CS | Tx | RTC_INT | MEM_CS | 485_RTS | MOSI | Rx | IRID_SLEEP | G | RTS | TR_CHARGE | S2_3.3V | Tx-O | MISO | A | CLK | B | Rx-I | N.C. | S1_3.3V | GND3 | CLK | MISO | MOSI | CS | N.C. | S2_ | INT | 3.3V | 3.3V | GND2 | MISO | 5V N.C. | E | B | N.C. | SCL | DN.B | RS.B | GND2 | SCK | MOSI | MTR_DIR | N.C. | GPS Time Pulse | C | Reset N.C. | GND2 | MTR_STEP | N.C. | S1 for MEM&PRS_SNSR | S2 for RS485 & GPS | MTR_SLEEP | MTR.EN | SL | Tx | Rx | E | 3.3V | SDA | UP.B | CK.B | LED | MTR_RST | UP.B | SDA | SCL | B | GND2 | S1_3.3V | DIR | STEP | GND2 | 3.3V | SLEEP | RST | M3 | M2 | M1 | EN | MTR_M3 | N.C. | C | N.C. | GND | 5V | MTR_M2 | DN.B | N.C. | D_A | D_B | P | C | G | MTR_M1 | RST.B | LD.IN | CHK.B | GND4 | N.C. | N.C. | GND | 12V | F | N.C. | 12V | N.C | N.C | N.C | 5V | NC | 12V | 3.3V | GND1 | A- | B- | 12V | GND | B- | B+ | A- | A+ | A+ | B+